# Altium schematic sheet power.SchDoc
size A4; SheetNumber: 1; SheetTotal: 4
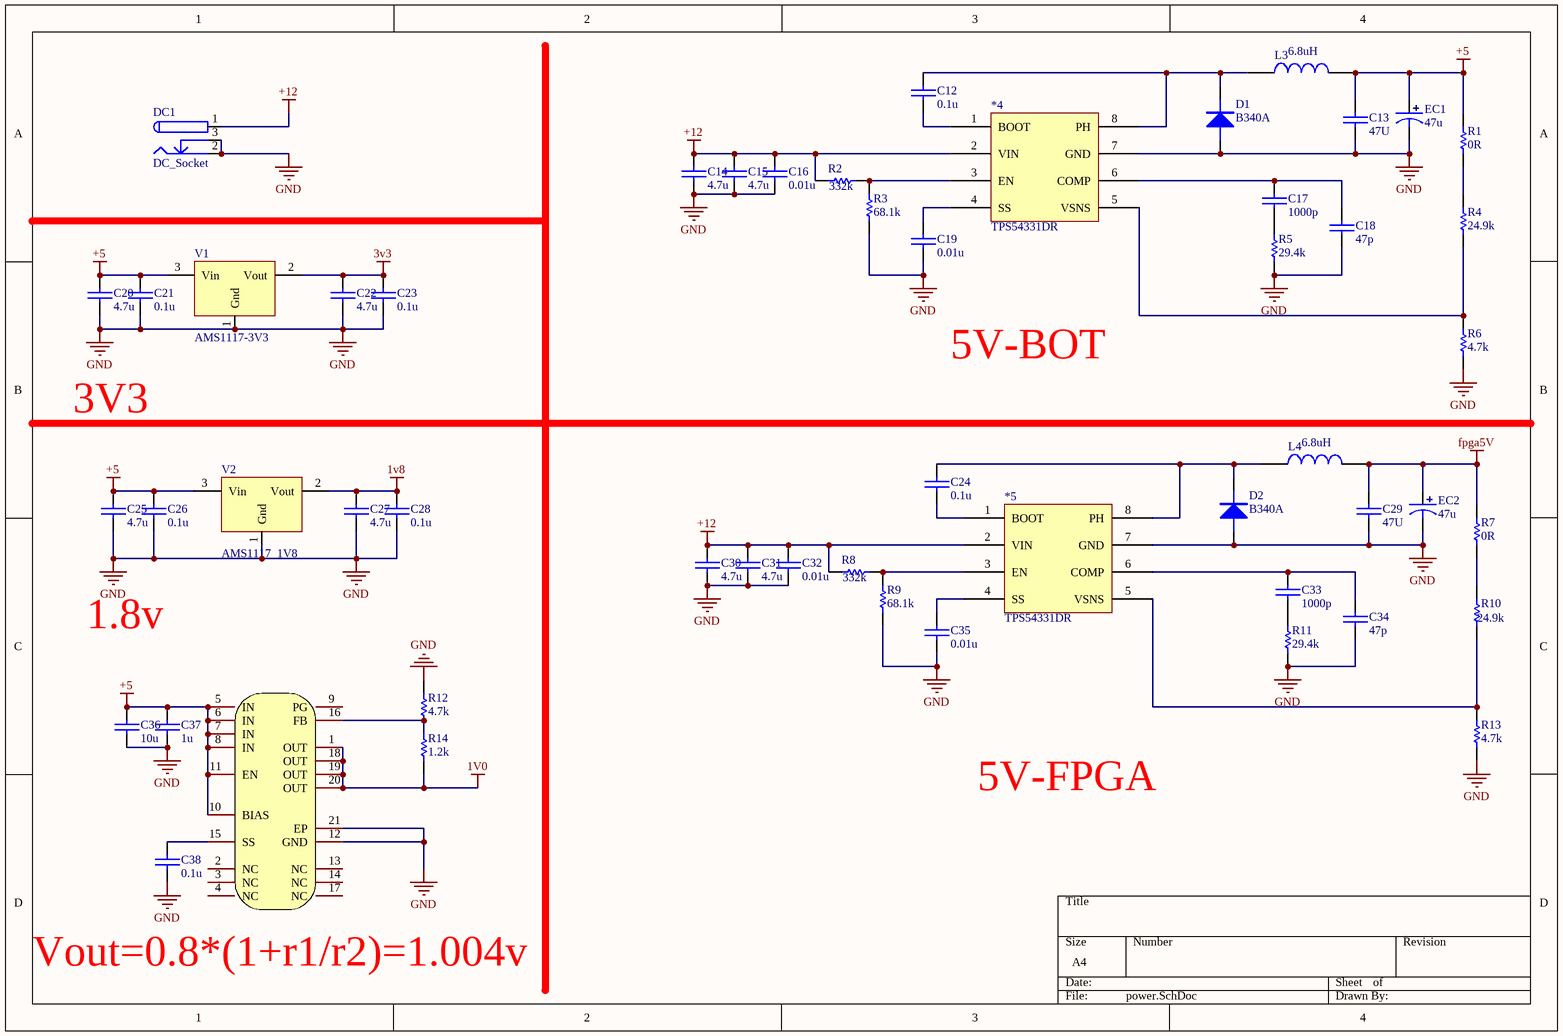
[diagram p0: power.SchDoc]

## Parts
*4  TPS54331DR  [SOIC-8]
*5  TPS54331DR  [SOIC-8]
C12  0.1u  [0603C]
C13  47U  [0603C]
C14  4.7u  [0603C]
C15  4.7u  [0603C]
C16  0.01u  [0603C]
C17  1000p  [0603C]
C18  47p  [0603C]
C19  0.01u  [0603C]
C20  4.7u  [0603C]
C21  0.1u  [0603C]
C22  4.7u  [0603C]
C23  0.1u  [0603C]
C24  0.1u  [0603C]
C25  4.7u  [0603C]
C26  0.1u  [0603C]
C27  4.7u  [0603C]
C28  0.1u  [0603C]
C29  47U  [0603C]
C30  4.7u  [0603C]
C31  4.7u  [0603C]
C32  0.01u  [0603C]
C33  1000p  [0603C]
C34  47p  [0603C]
C35  0.01u  [0603C]
C36  10u  [0603C]
C37  1u  [0603C]
C38  0.1u  [0603C]
D1  B340A  [SMA/DO-214AC]
D2  B340A  [SMA/DO-214AC]
DC1  DC_Socket  [DC-005]
EC1  47u  [SMD-EC6.3X6.3X10]
EC2  47u  [SMD-EC6.3X6.3X10]
L3  6.8uH  [L-SMD-0630]
L4  6.8uH  [L-SMD-0630]
R1  0R  [0603R]
R2  332k  [0603R]
R3  68.1k  [0603R]
R4  24.9k  [0603R]
R5  29.4k  [0603R]
R6  4.7k  [0603R]
R7  0R  [0603R]
R8  332k  [0603R]
R9  68.1k  [0603R]
R10  24.9k  [0603R]
R11  29.4k  [0603R]
R12  4.7k  [0603R]
R13  4.7k  [0603R]
R14  1.2k  [0603R]
U3  TPS74401RGWR  [VQFN-20_L5.0-W5.0-P0.65-TL-EP]  (value not drawn)
V1  AMS1117-3V3  [SOT223_L]
V2  AMS1117_1V8  [SOT223_L]

## Nets
1V0: R14.1 U3.1(OUT) U3.18(OUT) U3.19(OUT) U3.20(OUT)
1v8: C27.2 C28.2 V2.2(Vout)
3v3: C22.2 C23.2 V1.2(Vout)
+5: C13.2 C20.2 C21.2 C25.2 C26.2 C36.2 C37.2 EC1.1 L3.2 R1.2 U3.5(IN) U3.6(IN) U3.7(IN) U3.8(IN) U3.10(BIAS) U3.11(EN) V1.3(Vin) V2.3(Vin)
+12: *4.2(VIN) *5.2(VIN) C14.2 C15.2 C16.2 C30.2 C31.2 C32.2 DC1.1 R2.2 R8.2
fpga5V: C29.2 EC2.1 L4.2 R7.2
GND: *4.7(GND) *5.7(GND) C13.1 C14.1 C15.1 C16.1 C18.1 C19.1 C20.1 C21.1 C22.1 C23.1 C25.1 C26.1 C27.1 C28.1 C29.1 C30.1 C31.1 C32.1 C34.1 C35.1 C36.1 C37.1 C38.1 D1.A D2.A DC1.2 DC1.3 EC1.2 EC2.2 R3.1 R5.1 R6.1 R9.1 R11.1 R12.2 R13.1 U3.12(GND) U3.21(EP) V1.1(Gnd) V2.1(Gnd)
Net*4_1: *4.1(BOOT) C12.1
Net*4_3: *4.3(EN) R2.1 R3.2
Net*4_4: *4.4(SS) C19.2
Net*4_5: *4.5(VSNS) R4.1 R6.2
Net*4_6: *4.6(COMP) C17.2 C18.2
Net*4_8: *4.8(PH) C12.2 D1.K L3.1
Net*5_1: *5.1(BOOT) C24.1
Net*5_3: *5.3(EN) R8.1 R9.2
Net*5_4: *5.4(SS) C35.2
Net*5_5: *5.5(VSNS) R10.1 R13.2
Net*5_6: *5.6(COMP) C33.2 C34.2
Net*5_8: *5.8(PH) C24.2 D2.K L4.1
NetC17_1: C17.1 R5.2
NetC33_1: C33.1 R11.2
NetC38_2: C38.2 U3.15(SS)
NetR1_1: R1.1 R4.2
NetR7_1: R7.1 R10.2
NetR12_1: R12.1 R14.2 U3.16(FB)

Not connected (* = marked no-connect by the designer): U3 2(NC) 3(NC) 4(NC) 9(PG) 13(NC) 14(NC) 17(NC)

## Notes on the sheet
- 5V-BOT
- 3V3
- 1.8v
- 5V-FPGA
- (near U3) Vout=0.8*(1+r1/r2)=1.004v

## Library data of the parts
*4 *5 = TPS54331DR: 降压型DC-DC
C12-C38 = CAP: 无极性电容
D1 D2 = DIODE: 普通二极管
EC1 EC2 = ECAP: 贴片电解电容
L3 L4 = L: INDUCTOR
R1-R14 = RES: 电阻
U3 = TPS74401RGWR: 单路输出 LDO、3.0A、可调节电压（0.8 至 3.3V）、快速瞬态响应、可编程软启动; Manufacturer: TI(德州仪器); Add into BOM: yes; Voltage - Input (Max): 5.5V; Voltage Dropout (Max): 240mV @ 3A; Voltage - Output (adj): 0.8V ~ 3.6V; Output Current (Max): 3A; Output Configuration: 正; Ripple Rejection (PSRR): 73dB ~ 50dB(1kHz ~ 800kHz); Output Type: 可调式; Number of Output Channels: 1; Name: TPS74401RGWR; Symbol: TPS74401RGWR; Device: TPS74401RGWR; LCSC Part Name: TPS74401RGWR; Supplier Part: C138728; Manufacturer Part: TPS74401RGWR; Supplier Footprint: VQFN-20_5x5x065P; JLCPCB Part Class: Extended Part; Datasheet: https://atta.szlcsc.com/upload/public/pdf/source/20171102/C138728_15096093098431078457.pdf; Supplier: LCSC; Convert to PCB: yes; Quiescent Current (Iq): -; Current - Supply (Max): -; Operating Temperature: -40℃~125℃(TJ); Enabling feet: -; Voltage - Output (Fixed): -
V1 = AMS1117-3V3: LDO; BOM名称: 稳压芯片; 封装库来自淘宝卖家：黄晶宝石: 其他店铺购入的买家，请立即申请退款，本店现金奖励200~1000元
V2 = AMS1117_1V8: LDO; BOM名称: 稳压芯片; 封装库来自淘宝卖家：黄晶宝石: 其他店铺购入的买家，请立即申请退款，本店现金奖励200~1000元